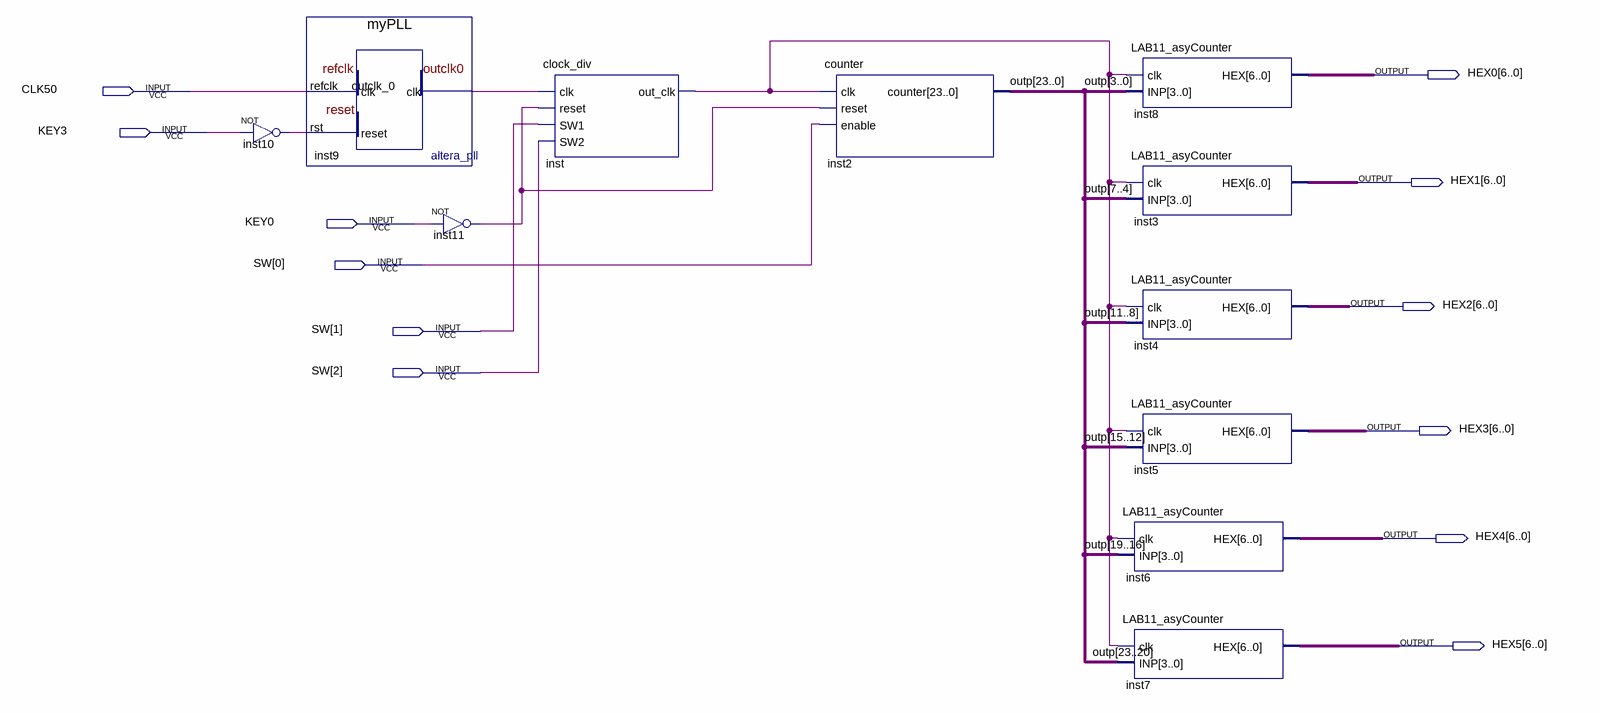
[diagram p0: schematic sheet]
// Quartus schematic Lab11.bdf as structural Verilog: 11 symbols, 12 pins
module Lab11 (
  input  CLK50,
  input  KEY3,
  input  KEY0,
  input  [2:0] SW,
  output [6:0] HEX0,
  output [6:0] HEX1,
  output [6:0] HEX2,
  output [6:0] HEX3,
  output [6:0] HEX4,
  output [6:0] HEX5
);

  wire inst9_outclk_0, inst10_out, inst11_out, inst_out_clk;
  wire [23:0] outp;

  not inst10 (inst10_out, KEY3);
  myPLL inst9 (.refclk(CLK50), .rst(inst10_out), .outclk_0(inst9_outclk_0));
  not inst11 (inst11_out, KEY0);
  clock_div inst (.clk(inst9_outclk_0), .reset(inst11_out), .SW1(SW[1]), .SW2(SW[2]), .out_clk(inst_out_clk));
  counter inst2 (.clk(inst_out_clk), .reset(inst11_out), .enable(SW[0]), .counter(outp));
  LAB11_asyCounter inst8 (.clk(inst_out_clk), .INP(outp[3:0]), .HEX(HEX0));
  LAB11_asyCounter inst3 (.clk(inst_out_clk), .INP(outp[7:4]), .HEX(HEX1));
  LAB11_asyCounter inst4 (.clk(inst_out_clk), .INP(outp[11:8]), .HEX(HEX2));
  LAB11_asyCounter inst5 (.clk(inst_out_clk), .INP(outp[15:12]), .HEX(HEX3));
  LAB11_asyCounter inst6 (.clk(inst_out_clk), .INP(outp[19:16]), .HEX(HEX4));
  LAB11_asyCounter inst7 (.clk(inst_out_clk), .INP(outp[23:20]), .HEX(HEX5));
endmodule
